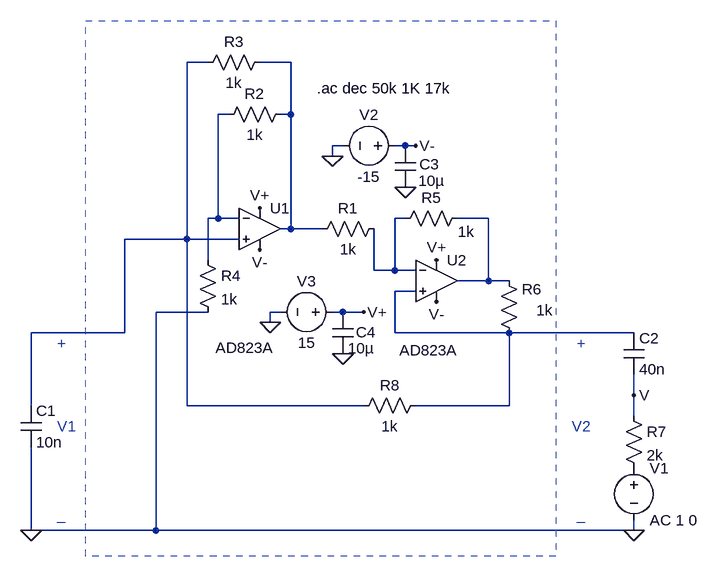
[diagram p0: schematic Gyrator.asc]
Gyrator.asc, the LTspice schematic file:
Version 4
SHEET 1 944 688
WIRE -16 -96 -48 -96
WIRE 112 -96 64 -96
WIRE 16 -16 0 -16
WIRE 112 -16 112 -96
WIRE 112 -16 96 -16
WIRE 192 32 176 32
WIRE 288 32 272 32
WIRE 304 32 288 32
WIRE 176 48 176 32
WIRE 0 144 0 -16
WIRE 0 144 -16 144
WIRE 32 144 0 144
WIRE 288 144 272 144
WIRE 416 144 368 144
WIRE 112 160 112 -16
WIRE 112 160 96 160
WIRE 160 160 112 160
WIRE -48 176 -48 -96
WIRE -48 176 -144 176
WIRE 32 176 -48 176
WIRE -16 208 -16 144
WIRE 240 224 240 160
WIRE 272 224 272 144
WIRE 272 224 240 224
WIRE 304 224 272 224
WIRE 416 240 416 144
WIRE 416 240 368 240
WIRE 448 240 416 240
WIRE 304 256 272 256
WIRE -16 288 -96 288
WIRE 96 288 80 288
WIRE 192 288 176 288
WIRE 224 288 192 288
WIRE 80 304 80 288
WIRE -144 320 -144 176
WIRE -144 320 -288 320
WIRE 272 320 272 256
WIRE 448 320 272 320
WIRE 640 320 448 320
WIRE 640 416 640 384
WIRE -288 432 -288 320
WIRE -48 432 -48 176
WIRE 224 432 -48 432
WIRE 448 432 448 320
WIRE 448 432 304 432
WIRE 640 448 640 416
WIRE -288 624 -288 496
WIRE -96 624 -96 288
WIRE -96 624 -288 624
WIRE 640 624 640 608
WIRE 640 624 -96 624
FLAG 336 208 V+
FLAG 64 128 V+
FLAG 336 272 V-
FLAG 64 192 V-
FLAG 304 32 V-
FLAG 224 288 V+
FLAG 176 48 0
FLAG 288 96 0
FLAG 80 304 0
FLAG 192 352 0
FLAG -288 624 0
FLAG 640 624 0
FLAG 640 416 V
SYMBOL AD823A 64 96 R0
WINDOW 3 -68 247 Left 2
SYMATTR InstName U1
SYMBOL AD823A 336 176 R0
WINDOW 3 -57 171 Left 2
SYMATTR InstName U2
SYMBOL res 256 144 R90
WINDOW 0 0 56 VBottom 2
WINDOW 3 32 56 VTop 2
SYMATTR InstName R1
SYMATTR Value 1k
SYMBOL res 384 128 R90
WINDOW 0 0 56 VBottom 2
WINDOW 3 21 2 VTop 2
SYMATTR InstName R5
SYMATTR Value 1k
SYMBOL res 464 336 R180
WINDOW 0 -34 83 Left 2
WINDOW 3 -51 51 Left 2
SYMATTR InstName R6
SYMATTR Value 1k
SYMBOL voltage 288 32 R90
WINDOW 0 -32 56 VBottom 2
WINDOW 3 32 56 VTop 2
WINDOW 123 0 0 Left 0
WINDOW 39 0 0 Left 0
SYMATTR InstName V2
SYMATTR Value -15
SYMBOL voltage 192 288 R90
WINDOW 0 -32 56 VBottom 2
WINDOW 3 32 56 VTop 2
WINDOW 123 0 0 Left 0
WINDOW 39 0 0 Left 0
SYMATTR InstName V3
SYMATTR Value 15
SYMBOL cap 272 32 R0
WINDOW 0 38 29 Left 2
WINDOW 3 36 54 Left 2
SYMATTR InstName C3
SYMATTR Value 10µ
SYMBOL cap 176 288 R0
WINDOW 0 36 31 Left 2
SYMATTR InstName C4
SYMATTR Value 10µ
SYMBOL res 112 -32 R90
WINDOW 0 0 56 VBottom 2
WINDOW 3 32 56 VTop 2
SYMATTR InstName R2
SYMATTR Value 1k
SYMBOL res 80 -112 R90
WINDOW 0 0 56 VBottom 2
WINDOW 3 32 56 VTop 2
SYMATTR InstName R3
SYMATTR Value 1k
SYMBOL res -32 192 R0
SYMATTR InstName R4
SYMATTR Value 1k
SYMBOL res 320 416 R90
WINDOW 0 0 56 VBottom 2
WINDOW 3 32 56 VTop 2
SYMATTR InstName R8
SYMATTR Value 1k
SYMBOL cap -304 432 R0
SYMATTR InstName C1
SYMATTR Value 10n
SYMBOL cap 624 320 R0
SYMATTR InstName C2
SYMATTR Value 40n
SYMBOL res 624 432 R0
SYMATTR InstName R7
SYMATTR Value 2k
SYMBOL voltage 640 512 R0
SYMATTR InstName V1
SYMATTR Value AC 1 0
TEXT 152 -56 Left 2 !.ac dec 50k 1K 17k
TEXT -248 464 Left 2 ;V1
TEXT -248 336 Left 2 ;+
TEXT -248 600 Left 2 ;_
TEXT 552 336 Left 2 ;+
TEXT 552 600 Left 2 ;_
TEXT 544 464 Left 2 ;V2
RECTANGLE Normal -204 -160 520 664 2

The netlist it stands for:
* Gyrator.asc
* U1: AD823A (symbol AD823A not available, pins judged from their places): In+=N001 In-=N003 V+=V+ V-=V- OUT=N002
* U2: AD823A (symbol AD823A not available, pins judged from their places): In+=N006 In-=N004 V+=V+ V-=V- OUT=N005
R1 N004 N002 1k
R5 N005 N004 1k
R6 N006 N005 1k
V2 V- 0 -15
V3 V+ 0 15
C3 V- 0 10µ
C4 V+ 0 10µ
R2 N002 N003 1k
R3 N002 N001 1k
R4 N003 0 1k
R8 N006 N001 1k
C1 N001 0 10n
C2 N006 V 40n
R7 V P001 2k
V1 P001 0 AC 1 0
.ac dec 50k 1K 17k
* V1
* +
* _
* +
* _
* V2
.backanno
.end